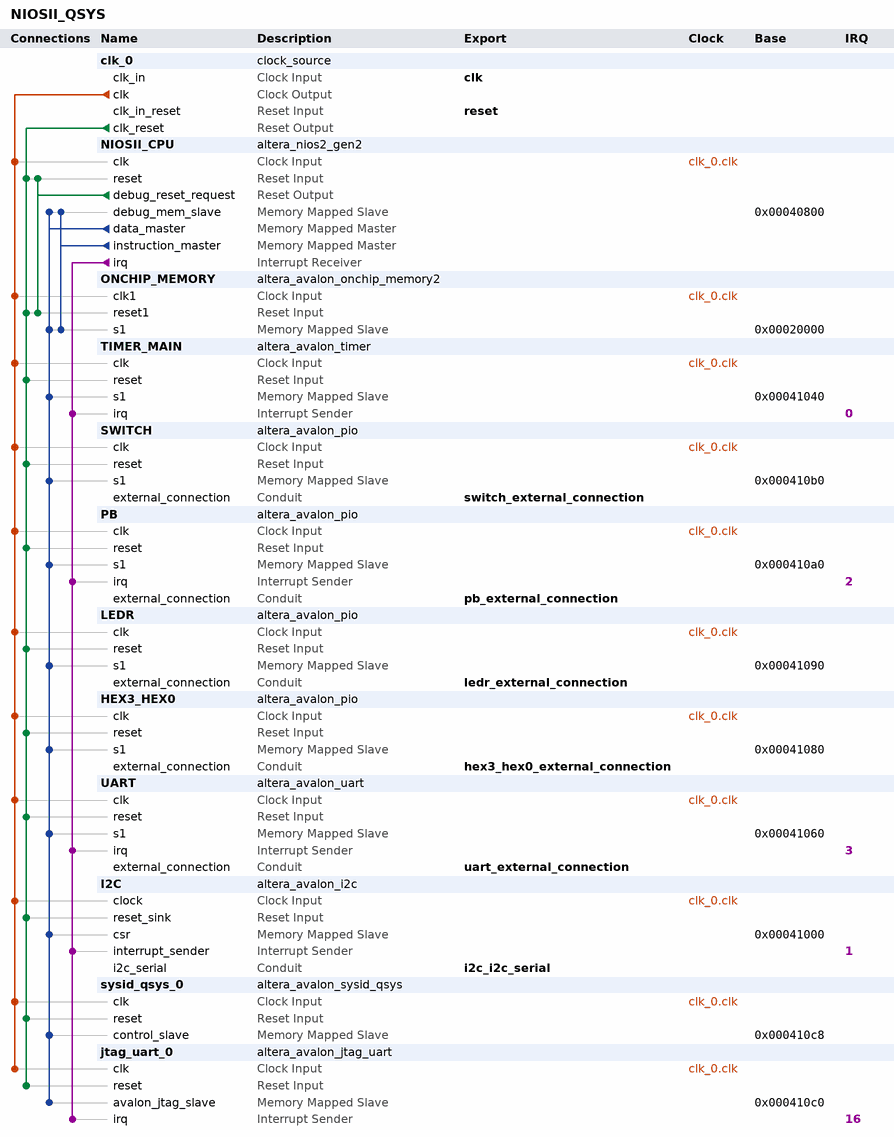
[diagram p0: system contents]
# Platform Designer (Qsys) system NIOSII_QSYS, MAX 10 10M50DAF484C7G
# Parameters at their usual value, and those the tool derives, are not listed.
package require -exact qsys 18.1
create_system NIOSII_QSYS
set_project_property DEVICE_FAMILY {MAX 10}
set_project_property DEVICE 10M50DAF484C7G

add_instance clk_0 clock_source 18.1
set_instance_parameter_value clk_0 clockFrequency 50000000

add_instance NIOSII_CPU altera_nios2_gen2 18.1
set_instance_parameter_value NIOSII_CPU dcache_size 0
set_instance_parameter_value NIOSII_CPU exceptionSlave ONCHIP_MEMORY.s1
set_instance_parameter_value NIOSII_CPU icache_size 2048
set_instance_parameter_value NIOSII_CPU impl Fast
set_instance_parameter_value NIOSII_CPU resetSlave ONCHIP_MEMORY.s1
set_instance_parameter_value NIOSII_CPU setting_branchpredictiontype Static

add_instance ONCHIP_MEMORY altera_avalon_onchip_memory2 18.1
set_instance_parameter_value ONCHIP_MEMORY dataWidth 32
set_instance_parameter_value ONCHIP_MEMORY dualPort false
set_instance_parameter_value ONCHIP_MEMORY initMemContent false
set_instance_parameter_value ONCHIP_MEMORY initializationFileName onchip_mem.hex
set_instance_parameter_value ONCHIP_MEMORY memorySize 122880

add_instance TIMER_MAIN altera_avalon_timer 18.1
set_instance_parameter_value TIMER_MAIN period 1
set_instance_parameter_value TIMER_MAIN periodUnits MSEC

add_instance SWITCH altera_avalon_pio 18.1
set_instance_parameter_value SWITCH direction Input
set_instance_parameter_value SWITCH width 10

add_instance PB altera_avalon_pio 18.1
set_instance_parameter_value PB captureEdge true
set_instance_parameter_value PB direction Input
set_instance_parameter_value PB edgeType FALLING
set_instance_parameter_value PB generateIRQ true
set_instance_parameter_value PB irqType EDGE
set_instance_parameter_value PB width 2

add_instance LEDR altera_avalon_pio 18.1
set_instance_parameter_value LEDR direction Output
set_instance_parameter_value LEDR resetValue 597
set_instance_parameter_value LEDR width 10

add_instance HEX3_HEX0 altera_avalon_pio 18.1
set_instance_parameter_value HEX3_HEX0 direction Output
set_instance_parameter_value HEX3_HEX0 resetValue 1077952576
set_instance_parameter_value HEX3_HEX0 width 32

add_instance UART altera_avalon_uart 18.1
set_instance_parameter_value UART baud 115200
set_instance_parameter_value UART dataBits 8
set_instance_parameter_value UART fixedBaud true
set_instance_parameter_value UART parity NONE
set_instance_parameter_value UART stopBits 1

add_instance I2C altera_avalon_i2c 18.1
set_instance_parameter_value I2C FIFO_DEPTH 4

add_instance sysid_qsys_0 altera_avalon_sysid_qsys 18.1
set_instance_parameter_value sysid_qsys_0 id 305419896

add_instance jtag_uart_0 altera_avalon_jtag_uart 18.1
set_instance_parameter_value jtag_uart_0 simInteractiveOptions NO_INTERACTIVE_WINDOWS

# connections
add_connection clk_0.clk HEX3_HEX0.clk clock
add_connection clk_0.clk I2C.clock clock
add_connection clk_0.clk jtag_uart_0.clk clock
add_connection clk_0.clk LEDR.clk clock
add_connection clk_0.clk NIOSII_CPU.clk clock
add_connection clk_0.clk ONCHIP_MEMORY.clk1 clock
add_connection clk_0.clk PB.clk clock
add_connection clk_0.clk SWITCH.clk clock
add_connection clk_0.clk sysid_qsys_0.clk clock
add_connection clk_0.clk TIMER_MAIN.clk clock
add_connection clk_0.clk UART.clk clock
add_connection clk_0.clk_reset HEX3_HEX0.reset reset
add_connection clk_0.clk_reset I2C.reset_sink reset
add_connection clk_0.clk_reset jtag_uart_0.reset reset
add_connection clk_0.clk_reset LEDR.reset reset
add_connection clk_0.clk_reset NIOSII_CPU.reset reset
add_connection clk_0.clk_reset ONCHIP_MEMORY.reset1 reset
add_connection clk_0.clk_reset PB.reset reset
add_connection clk_0.clk_reset SWITCH.reset reset
add_connection clk_0.clk_reset sysid_qsys_0.reset reset
add_connection clk_0.clk_reset TIMER_MAIN.reset reset
add_connection clk_0.clk_reset UART.reset reset
add_connection NIOSII_CPU.debug_reset_request NIOSII_CPU.reset reset
add_connection NIOSII_CPU.debug_reset_request ONCHIP_MEMORY.reset1 reset
add_connection NIOSII_CPU.data_master HEX3_HEX0.s1 avalon
set_connection_parameter_value NIOSII_CPU.data_master/HEX3_HEX0.s1 baseAddress 0x00041080
add_connection NIOSII_CPU.data_master I2C.csr avalon
set_connection_parameter_value NIOSII_CPU.data_master/I2C.csr baseAddress 0x00041000
add_connection NIOSII_CPU.data_master jtag_uart_0.avalon_jtag_slave avalon
set_connection_parameter_value NIOSII_CPU.data_master/jtag_uart_0.avalon_jtag_slave baseAddress 0x000410c0
add_connection NIOSII_CPU.data_master LEDR.s1 avalon
set_connection_parameter_value NIOSII_CPU.data_master/LEDR.s1 baseAddress 0x00041090
add_connection NIOSII_CPU.data_master NIOSII_CPU.debug_mem_slave avalon
set_connection_parameter_value NIOSII_CPU.data_master/NIOSII_CPU.debug_mem_slave baseAddress 0x00040800
add_connection NIOSII_CPU.data_master ONCHIP_MEMORY.s1 avalon
set_connection_parameter_value NIOSII_CPU.data_master/ONCHIP_MEMORY.s1 baseAddress 0x00020000
add_connection NIOSII_CPU.data_master PB.s1 avalon
set_connection_parameter_value NIOSII_CPU.data_master/PB.s1 baseAddress 0x000410a0
add_connection NIOSII_CPU.data_master SWITCH.s1 avalon
set_connection_parameter_value NIOSII_CPU.data_master/SWITCH.s1 baseAddress 0x000410b0
add_connection NIOSII_CPU.data_master sysid_qsys_0.control_slave avalon
set_connection_parameter_value NIOSII_CPU.data_master/sysid_qsys_0.control_slave baseAddress 0x000410c8
add_connection NIOSII_CPU.data_master TIMER_MAIN.s1 avalon
set_connection_parameter_value NIOSII_CPU.data_master/TIMER_MAIN.s1 baseAddress 0x00041040
add_connection NIOSII_CPU.data_master UART.s1 avalon
set_connection_parameter_value NIOSII_CPU.data_master/UART.s1 baseAddress 0x00041060
add_connection NIOSII_CPU.instruction_master NIOSII_CPU.debug_mem_slave avalon
set_connection_parameter_value NIOSII_CPU.instruction_master/NIOSII_CPU.debug_mem_slave baseAddress 0x00040800
add_connection NIOSII_CPU.instruction_master ONCHIP_MEMORY.s1 avalon
set_connection_parameter_value NIOSII_CPU.instruction_master/ONCHIP_MEMORY.s1 baseAddress 0x00020000
add_connection NIOSII_CPU.irq I2C.interrupt_sender interrupt
set_connection_parameter_value NIOSII_CPU.irq/I2C.interrupt_sender irqNumber 1
add_connection NIOSII_CPU.irq jtag_uart_0.irq interrupt
set_connection_parameter_value NIOSII_CPU.irq/jtag_uart_0.irq irqNumber 16
add_connection NIOSII_CPU.irq PB.irq interrupt
set_connection_parameter_value NIOSII_CPU.irq/PB.irq irqNumber 2
add_connection NIOSII_CPU.irq TIMER_MAIN.irq interrupt
set_connection_parameter_value NIOSII_CPU.irq/TIMER_MAIN.irq irqNumber 0
add_connection NIOSII_CPU.irq UART.irq interrupt
set_connection_parameter_value NIOSII_CPU.irq/UART.irq irqNumber 3

# exported interfaces
add_interface clk clock sink
set_interface_property clk EXPORT_OF clk_0.clk_in
add_interface hex3_hex0_external_connection conduit end
set_interface_property hex3_hex0_external_connection EXPORT_OF HEX3_HEX0.external_connection
add_interface i2c_i2c_serial conduit end
set_interface_property i2c_i2c_serial EXPORT_OF I2C.i2c_serial
add_interface ledr_external_connection conduit end
set_interface_property ledr_external_connection EXPORT_OF LEDR.external_connection
add_interface pb_external_connection conduit end
set_interface_property pb_external_connection EXPORT_OF PB.external_connection
add_interface reset reset sink
set_interface_property reset EXPORT_OF clk_0.clk_in_reset
add_interface switch_external_connection conduit end
set_interface_property switch_external_connection EXPORT_OF SWITCH.external_connection
add_interface uart_external_connection conduit end
set_interface_property uart_external_connection EXPORT_OF UART.external_connection

set_interconnect_requirement {$system} qsys_mm.clockCrossingAdapter HANDSHAKE
set_interconnect_requirement {$system} qsys_mm.enableEccProtection FALSE
set_interconnect_requirement {$system} qsys_mm.insertDefaultSlave FALSE
set_interconnect_requirement {$system} qsys_mm.maxAdditionalLatency 1

save_system NIOSII_QSYS.qsys
